# Altium schematic sheet Memory.SchDoc: SDRAM
size A4; Project: STM32H7-DK; Date: Not used; ApprovedBy: Not used; CheckedBy: Not used; Author: Not used; CompanyName: STMicroelectronics; DrawnBy: Not used; Engineer: Not used; Organization: Not used; Address1: Not used; Address2: Not used; Address3: Not used; Address4: Not used; DocumentNumber: Not used; Revision: Not used; SheetNumber: 5; SheetTotal: 16; CurrentTime: Not used; CurrentDate: Not used; Time: Not used; DocumentFullPathAndName: Not used; DocumentName: Not used; ModifiedDate: Not used; ImagePath: Not used; ProjectName: Not used; Application_BuildNumber: Not used
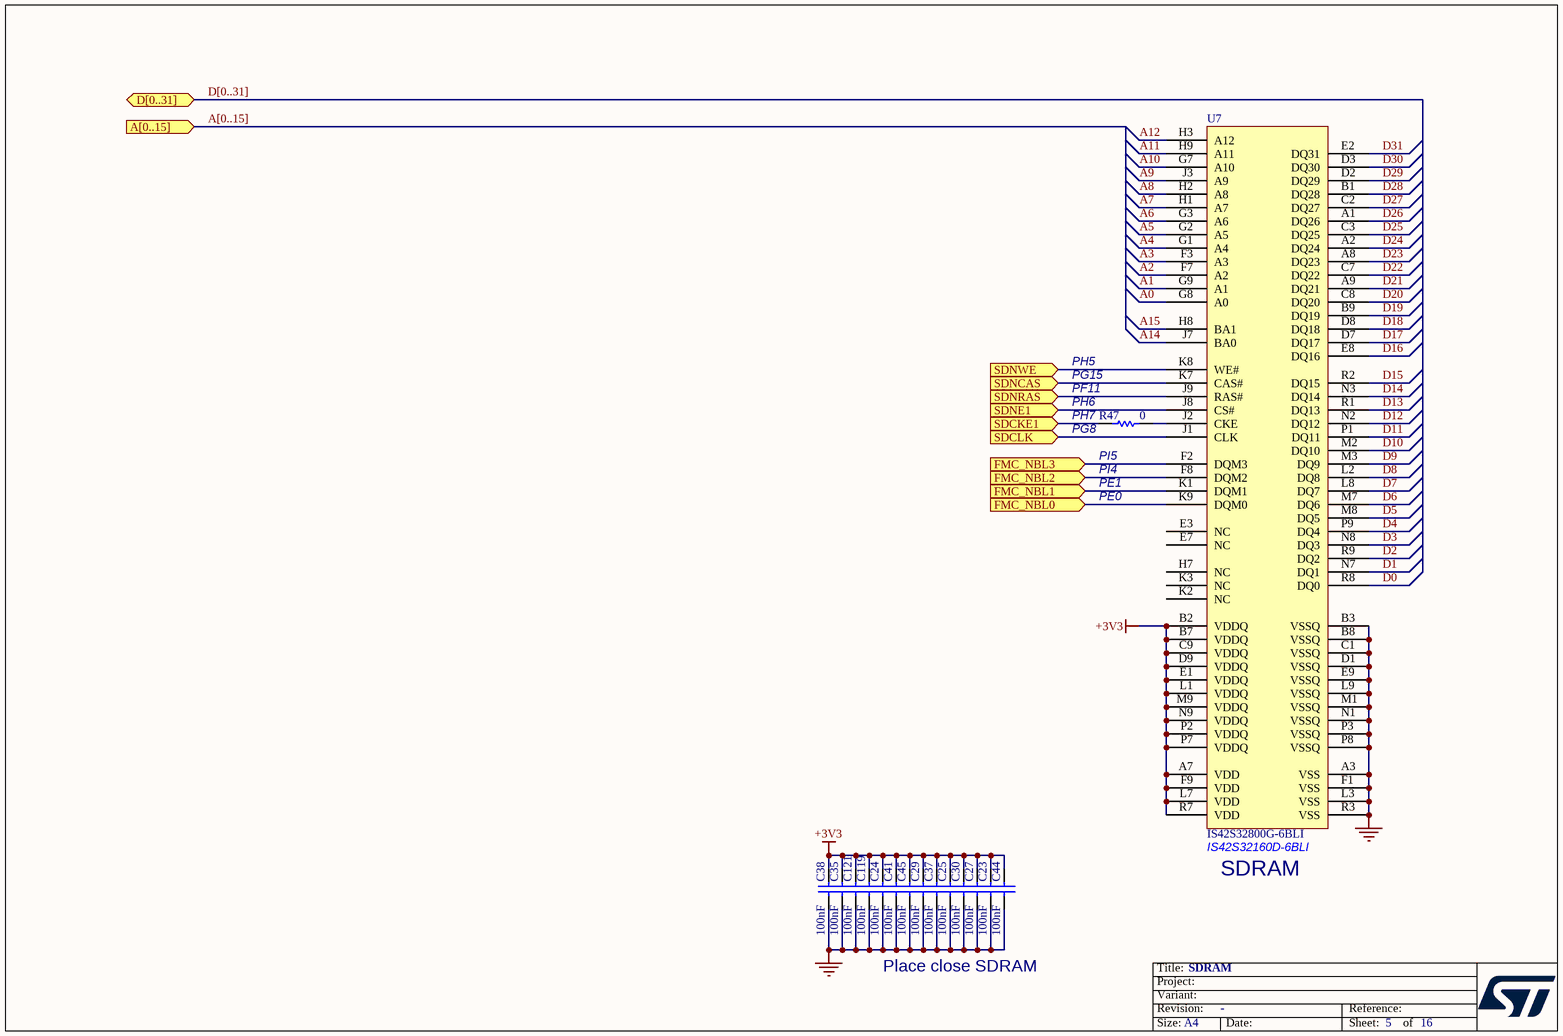
[diagram p0: Memory.SchDoc]

## Parts
C23  100nF  [0603C]
C24  100nF  [0603C]
C25  100nF  [0603C]
C27  100nF  [0603C]
C29  100nF  [0603C]
C30  100nF  [0603C]
C35  100nF  [0603C]
C37  100nF  [0603C]
C38  100nF  [0603C]
C41  100nF  [0603C]
C44  100nF  [0603C]
C45  100nF  [0603C]
C119  100nF  [0603C]
C121  100nF  [0603C]
R47  0  [0603R]
U7  IS42S32800G-6BLI  [FBGA90_0R8_8X13]

## Ports
A[0..15] (in), D[0..31] (bidir), FMC_NBL0 (in), FMC_NBL1 (in), FMC_NBL2 (in), FMC_NBL3 (in), SDCKE1 (in), SDCLK (in), SDNCAS (in), SDNE1 (in), SDNRAS (in), SDNWE (in)

## Nets
+3V3: C23.1 C24.1 C25.1 C27.1 C29.1 C30.1 C35.1 C37.1 C38.1 C41.1 C44.1 C45.1 C119.1 C121.1 U7.A7(VDD) U7.B2(VDDQ) U7.B7(VDDQ) U7.C9(VDDQ) U7.D9(VDDQ) U7.E1(VDDQ) U7.F9(VDD) U7.L1(VDDQ) U7.L7(VDD) U7.M9(VDDQ) U7.N9(VDDQ) U7.P2(VDDQ) U7.P7(VDDQ) U7.R7(VDD)
GND: C23.2 C24.2 C25.2 C27.2 C29.2 C30.2 C35.2 C37.2 C38.2 C41.2 C44.2 C45.2 C119.2 C121.2 U7.A3(VSS) U7.B3(VSSQ) U7.B8(VSSQ) U7.C1(VSSQ) U7.D1(VSSQ) U7.E9(VSSQ) U7.F1(VSS) U7.L3(VSS) U7.L9(VSSQ) U7.M1(VSSQ) U7.N1(VSSQ) U7.P3(VSSQ) U7.P8(VSSQ) U7.R3(VSS)
A0: U7.G8(A0)
A1: U7.G9(A1)
A2: U7.F7(A2)
A3: U7.F3(A3)
A4: U7.G1(A4)
A5: U7.G2(A5)
A6: U7.G3(A6)
A7: U7.H1(A7)
A8: U7.H2(A8)
A9: U7.J3(A9)
A10: U7.G7(A10)
A11: U7.H9(A11)
A12: U7.H3(A12)
A14: U7.J7(BA0)
A15: U7.H8(BA1)
D0: U7.R8(DQ0)
D1: U7.N7(DQ1)
D2: U7.R9(DQ2)
D3: U7.N8(DQ3)
D4: U7.P9(DQ4)
D5: U7.M8(DQ5)
D6: U7.M7(DQ6)
D7: U7.L8(DQ7)
D8: U7.L2(DQ8)
D9: U7.M3(DQ9)
D10: U7.M2(DQ10)
D11: U7.P1(DQ11)
D12: U7.N2(DQ12)
D13: U7.R1(DQ13)
D14: U7.N3(DQ14)
D15: U7.R2(DQ15)
D16: U7.E8(DQ16)
D17: U7.D7(DQ17)
D18: U7.D8(DQ18)
D19: U7.B9(DQ19)
D20: U7.C8(DQ20)
D21: U7.A9(DQ21)
D22: U7.C7(DQ22)
D23: U7.A8(DQ23)
D24: U7.A2(DQ24)
D25: U7.C3(DQ25)
D26: U7.A1(DQ26)
D27: U7.C2(DQ27)
D28: U7.B1(DQ28)
D29: U7.D2(DQ29)
D30: U7.D3(DQ30)
D31: U7.E2(DQ31)
FMC_NBL0: U7.K9(DQM0) ; port FMC_NBL0
FMC_NBL1: U7.K1(DQM1) ; port FMC_NBL1
FMC_NBL2: U7.F8(DQM2) ; port FMC_NBL2
FMC_NBL3: U7.F2(DQM3) ; port FMC_NBL3
SDCKE1: R47.2 ; port SDCKE1
SDCLK: U7.J1(CLK) ; port SDCLK
SDNCAS: U7.K7(CAS#) ; port SDNCAS
SDNE1: U7.J8(CS#) ; port SDNE1
SDNRAS: U7.J9(RAS#) ; port SDNRAS
SDNWE: U7.K8(WE#) ; port SDNWE
NetR47_1: R47.1 U7.J2(CKE)

Not connected (* = marked no-connect by the designer): U7 E3(NC) E7(NC) H7(NC) K2(NC) K3(NC)

## Buses and harness runs
bus A[0..15] = port A[0..15]
bus D[0..31] = port D[0..31]

## Notes on the sheet
- PH5
- (near R47) PG15
- (near R47) PF11
- (near R47) PH6
- (near R47) PH7
- (near R47) PG8
- PE1
- PE0
- (near R47) PI5
- (near R47) PI4
- (near U7) IS42S32160D-6BLI
- (near U7) SDRAM
- Place close SDRAM
- Title:
- Project:
- Size:
- Revision:
- Variant:
- A4
- -
- Date:
- Reference:
- Sheet:
- of

## Library data of the parts
C23-C25 C27 C29 C30 C35 C37 C38 C41 C44 C45 C119 C121 = Cap: Capacitor; Value: 10nF; Published: 8-Jun-2000; Revision: July-2002: Re-released for DXP Platform.; Publisher: Altium Limited
R47 = Res1: Resistor; Value: 1K; Published: 8-Jun-2000; Revision: July-2002: Re-released for DXP Platform.; Publisher: Altium Limited
U7 = IS42S32160D-6BLI: Manuf_1: ISSI; Fitted: YES; Ordered by: Subcon; ECCN_US/EU: EAR99/NEC; Manuf_Part_1: IS42S32800G-6BLI